# EAGLE design BrushBotComm_C3 (EAGLE 6.4)
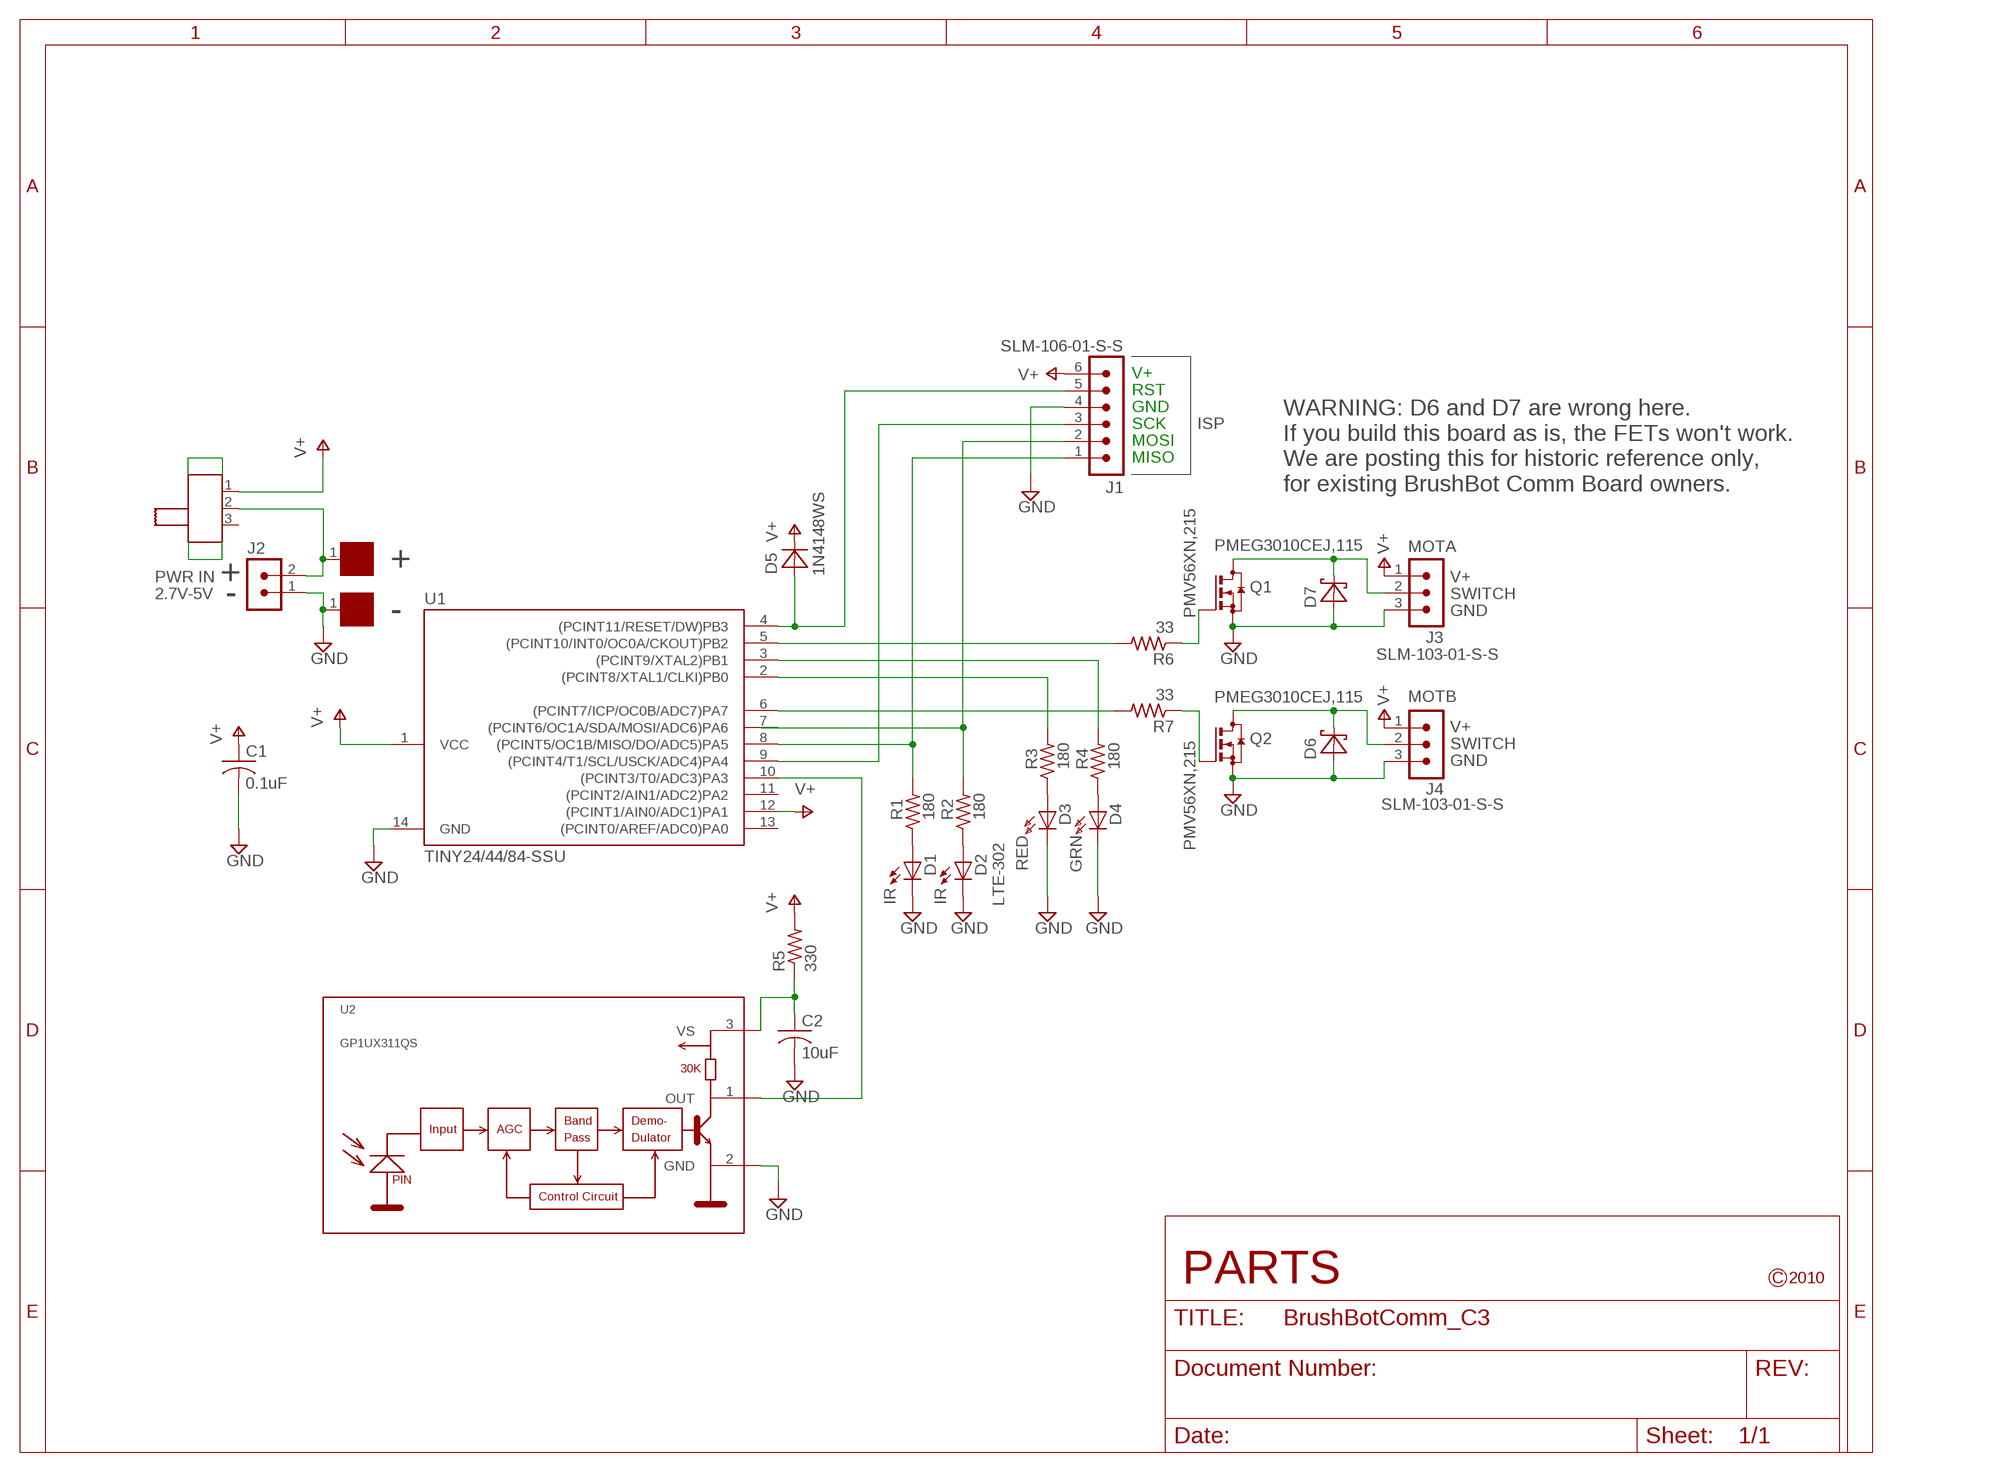
[diagram p0: schematic, sheet 1]

## Parts
+  BATTERM4X4MM  [BATTERM]
-  BATTERM4X4MM  [BATTERM]
C1  0.1uF  C-USC0603  [C0603]
C2  10uF  C-USC1206  [C1206]
D1  LTE-302  LEDIRL80A  [IRL80A]
D2  LTE-302  LEDIRL80A  [IRL80A]
D3  RED  LED603  [LED603]
D4  GRN  LED603  [LED603]
D5  1N4148WS  DIODE-SOD323-RE  [SOD323-R]
D6  PMEG3010CEJ,115  SCHOTTKYSOD323  [SOD323-R]
D7  PMEG3010CEJ,115  SCHOTTKYSOD323  [SOD323-R]
J1  SLM-106-01-S-S  MA06-1OCTPADS  [MA06O-1-25]
J2  MA02-1OCTPADS  [MA02O-1]
J3  SLM-103-01-S-S  MA03-1OCTPADS-25  [MA03O-1-25]
J4  SLM-103-01-S-S  MA03-1OCTPADS-25  [MA03O-1-25]
PWR  SSSS811101  SSSS8  [SSSS8]
Q1  PMV56XN,215  BSS123  [SOT23]
Q2  PMV56XN,215  BSS123  [SOT23]
R1  180  R-US_R0603  [R0603]
R2  180  R-US_R0603  [R0603]
R3  180  R-US_R0603  [R0603]
R4  180  R-US_R0603  [R0603]
R5  330  R-US_R0603  [R0603]
R6  33  R-US_R0603  [R0603]
R7  33  R-US_R0603  [R0603]
U1  TINY24/44/84-SSU  [SOIC14]
U2  GP1UX311QS  TSOP34830  [TSOP348]

## Nets
GND: -.1 C1.2 C2.2 D1.K(C) D2.K(C) D3.C D4.C D6.A D7.A J1.4 J2.1 J3.3 J4.3 Q1.2(S) Q2.2(S) U1.14(GND) U2.2(GND)
N$1: D1.A R1.1
N$2: D2.A R2.1
N$3: J1.2 R2.2 U1.7((PCINT6/OC1A/SDA/MOSI/ADC6)PA6)
N$4: J1.1 R1.2 U1.8((PCINT5/OC1B/MISO/DO/ADC5)PA5)
N$5: U1.10((PCINT3/T0/ADC3)PA3) U2.1(OUT)
N$6: R3.2 U1.2((PCINT8/XTAL1/CLKI)PB0)
N$7: R4.2 U1.3((PCINT9/XTAL2)PB1)
N$8: D3.A R3.1
N$9: D4.A R4.1
N$10: J1.3 U1.9((PCINT4/T1/SCL/USCK/ADC4)PA4)
N$11: D5.A J1.5 U1.4((PCINT11/RESET/DW)PB3)
N$12: C2.1 R5.1 U2.3(VS)
N$13: +.1 J2.2 PWR.2
N$14: PWR.G3 PWR.G4
N$15: PWR.G1 PWR.G2
N$16: R6.2 U1.5((PCINT10/INT0/OC0A/CKOUT)PB2)
N$17: R7.2 U1.6((PCINT7/ICP/OC0B/ADC7)PA7)
N$18: Q1.1(G) R6.1
N$19: Q2.1(G) R7.1
N$20: D7.C J3.2 Q1.3(D)
N$21: D6.C J4.2 Q2.3(D)
V+: C1.1 D5.C J1.6 J3.1 J4.1 PWR.1 R5.2 U1.1(VCC) U1.12((PCINT1/AIN0/ADC1)PA1)
Unconnected: PWR.3 U1.11((PCINT2/AIN1/ADC2)PA2) U1.13((PCINT0/AREF/ADC0)PA0)

## Notes on the sheet
- V+
- RST
- GND
- SCK | ISP
- MOSI
- MISO
- WARNING: D6 and D7 are wrong here.
  If you build this board as is, the FETs won't work.  
  We are posting this for historic reference only, 
  for existing BrushBot Comm Board owners.
- MOTA
- PWR IN | + | V+
- 2.7V-5V | SWITCH
- -
- GND
- MOTB
- V+
- SWITCH
- GND
- IR | IR
- PARTS | C | 2010

## Library data of the parts
+ - = battery_keystone:BATTERM: PCB button cell terminal
C1 C2 = my_rcl:C-US: CAPACITOR, American symbol
D1 D2 = led:LED: LED OSRAM: - CHIPLED LG R971, LG N971, LY N971, LG Q971, LY Q971, LO R971, LY R971 LH N974, LH R974 LS Q976, LO Q976, LY Q976 LO Q996 - Hyper CHIPLED LW Q18S LB Q993, LB Q99A, LB R99A - SideLED LS A670, LO A670, LY A670, LG A670, LP A670 LB A673, LV A673, LT A673, LW A673 LH A674 LY A675 LS A676, LA A676, LO A676, LY A676, LW A676 LS A679, LY A679, LG A679 - Hyper Micro SIDELED® LS Y876, LA Y876, LO Y876, LY Y876 LT Y87S - SmartLED LW L88C, LW L88S LB L89C, LB L89S, LG L890 LS L89K, LO L89K, LY L89K LS L896, LA L896, LO L896, LY L896 - TOPLED LS T670, LO T670, LY T670, LG T670, LP T670 LSG T670, LSP T670, LSY T670, LOP T670, LYG T670 LG T671, LOG T671, LSG T671 LB T673, LV T673, LT T673, LW T673 LH T674 LS T676, LA T676, LO T676, LY T676, LB T676, LH T676, LSB T676, LW T676 LB T67C, LV T67C, LT T67C, LS T67K, LO T67K, LY T67K, LW E67C LS E67B, LA E67B, LO E67B, LY E67B, LB E67C, LV E67C, LT E67C LW T67C LS T679, LY T679, LG T679 LS T770, LO T770, LY T770, LG T770, LP T770 LB T773, LV T773, LT T773, LW T773 LH T774 LS E675, LA E675, LY E675, LS T675 LS T776, LA T776, LO T776, LY T776, LB T776 LHGB T686 LT T68C, LB T68C - Hyper Mini TOPLED® LB M676 - Mini TOPLED Santana® LG M470 LS M47K, LO M47K, LY M47K Source: http://www.osram.convergy.de LUXEON: - LUMILED® LXK2-PW12-R00, LXK2-PW12-S00, LXK2-PW14-U00, LXK2-PW14-V00 LXK2-PM12-R00, LXK2-PM12-S00, LXK2-PM14-U00 LXK2-PE12-Q00, LXK2-PE12-R00, LXK2-PE12-S00, LXK2-PE14-T00, LXK2-PE14-U00 LXK2-PB12-K00, LXK2-PB12-L00, LXK2-PB12-M00, LXK2-PB14-N00, LXK2-PB14-P00, LXK2-PB14-Q00 LXK2-PR12-L00, LXK2-PR12-M00, LXK2-PR14-Q00, LXK2-PR14-R00 LXK2-PD12-Q00, LXK2-PD12-R00, LXK2-PD12-S00 LXK2-PH12-R00, LXK2-PH12-S00 LXK2-PL12-P00, LXK2-PL12-Q00, LXK2-PL12-R00 Source: www.luxeon.com KINGBRIGHT: KA-3528ASYC Source: www.kingbright.com
D3 D4 = my_led:LED603: Thin 603 LED Lite-ON
D5 = my_diode:DIODE-: DIODE
D6 D7 = my_diode:SCHOTTKY: Diodes Incorporated Schottky Diode SBR2A40P1-7
J1 = my_con:MA06-1
J2 = my_con:MA02-1: 0.050" 2-pin header
J3 J4 = my_con:MA03-1
PWR = microSwitch:SSSS8: ALPS SSSS811101 Miniature SPST side slide switch Also: COPAL CUS-12TB Also: C&K PCM12SMTR
Q1 Q2 = transistor-small-signal:BSS123: N-CHANNEL MOS FET
R1-R7 = my_rcl:R-US_: RESISTOR, American symbol
U1 = avr-6:TINY24/44/84
U2 = vishay-1:TSOP348*: IR Receiver Modules for Remote Control Systems http://www.vishay.com/ir-receiver-modules/

## Board
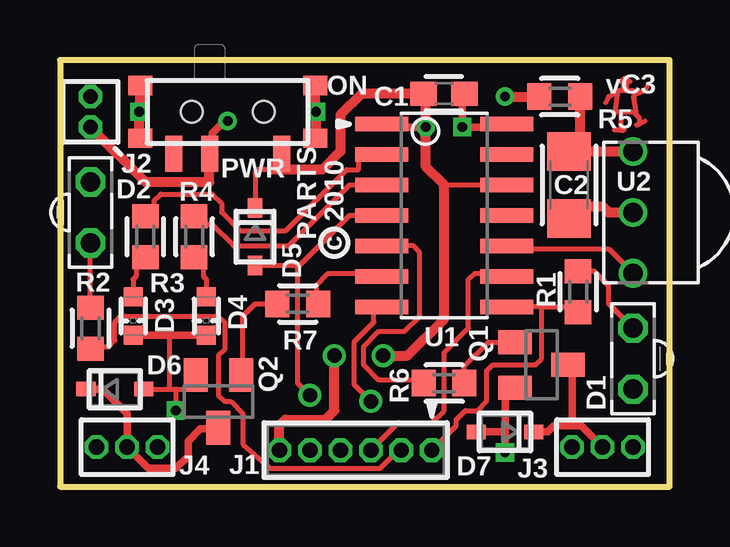
[diagram p1: board, top side]
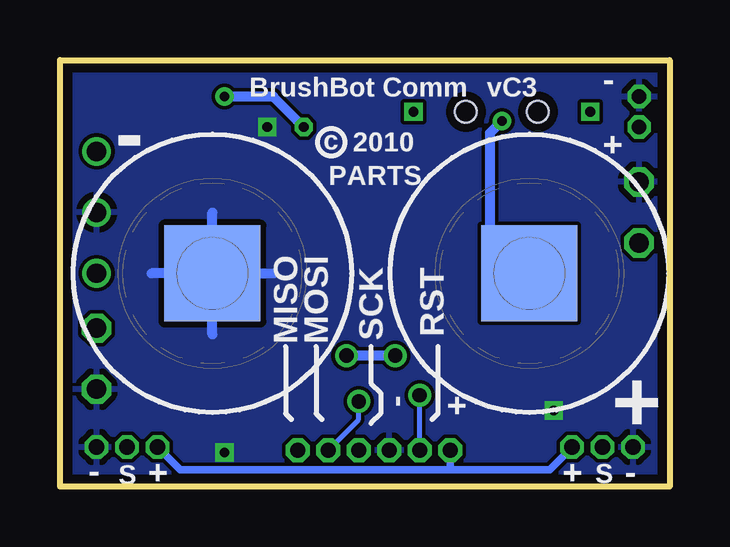
[diagram p2: board, bottom side, seen from below]

Size 25.4 x 17.78 mm. Coordinates in mm from the lower left corner, seen from the top.
Outline: 0,0 25.4,0 25.4,17.78 0,17.78 0,0
Copper layers (1*16): Top 0.0356mm / dielectric 1.5011mm / Bottom 0.0356mm
Design rules "LaenPCBOrder": minimum track width 6mil, minimum drill 13mil, track to track 6mil, track to pad 6mil, pad to pad 6mil, via to via 6mil, smd to smd 6mil, copper to edge 15mil, drill to drill 6mil, minimum pad ring 7mil, minimum via ring 7mil, stop-mask expansion 4mil, vias tented up to drill 0mil, thermal gap 10mil

### Footprints (pad centres in the part's own frame; a part is rotated, then mirrored left to right if it is on the bottom)
BATTERM = smd 4 x 4: 1 0,0
C0603 = smd 1.1 x 1: 1 -0.85,0; 2 0.85,0
C1206 = smd 1.6 x 1.8: 1 -1.4,0; 2 1.4,0
IRL80A = drill 0.813 octagon: A 0,-1.27; K 0,1.27
LED603 = smd 0.8 x 0.8: A -0.8,0; C 0.8,0
SOD323-R = smd 0.8 x 0.6: A 1.2,0; C -1.2,0
MA06O-1-25 = drill 0.635 pad 0.889 octagon: 1 -2.54,0; 2 -1.27,0; 3 0,0; 4 1.27,0; 5 2.54,0; 6 3.81,0
MA02O-1 = drill 0.61 pad 0.813 octagon: 1 -1.27,0; 2 0,0
MA03O-1-25 = drill 0.635 octagon: 1 -1.27,0; 2 0,0; 3 1.27,0
SSSS8 = smd 0.7 x 1.5: 1 -2.25,1.75; 2 0.75,1.75; 3 2.25,1.75 | smd 1 x 0.8: G1 -3.65,1.1; G2 -3.65,-1.1; G3 3.65,-1.1; G4 3.65,1.1 | hole 0.9: -1.5,0; 1.5,0
SOT23 = smd 1 x 1.4: 1 -0.95,-1.1; 2 0.95,-1.1; 3 0,1.1
R0603 = smd 1 x 1.1: 1 -0.85,0; 2 0.85,0
SOIC14 = smd 0.61 x 2.21: 1 -3.81,-2.603; 2 -2.54,-2.603; 3 -1.27,-2.603; 4 0,-2.603; 5 1.27,-2.603; 6 2.54,-2.603; 7 3.81,-2.603; 8 3.81,2.603; 9 2.54,2.603; 10 1.27,2.603; 11 0,2.603; 12 -1.27,2.603; 13 -2.54,2.603; 14 -3.81,2.603
TSOP348 = drill 0.8 round: 1 -2.54,0; 2 0,0; 3 2.54,0

### Placement (x,y rotation side)
+  5.84,8.89 0 bottom
-  19.05,8.89 0 bottom
C1  16,16.38 0 top
C2  21.21,12.57 270 top
D1  23.88,5.33 180 top
D2  1.27,11.43 0 top
D3  3.05,7.11 270 top
D4  6.1,7.11 270 top
D5  8.13,10.41 270 top
D6  2.29,4.06 0 top
D7  18.54,2.29 180 top
J1  12.95,1.52 180 top
J2  1.27,14.99 270 top
J3  22.61,1.65 0 top
J4  2.79,1.65 180 top
PWR  6.99,15.62 180 top
Q1  20.07,5.08 270 top
Q2  6.6,3.56 180 top
R1  21.59,8.13 270 top
R2  1.27,6.6 270 top
R3  3.56,10.41 90 top
R4  5.59,10.41 90 top
R5  20.83,16.26 180 top
R6  16,4.32 180 top
R7  9.91,7.62 0 top
U1  16,11.3 270 top
U2  23.88,11.43 90 top
U$1  [CHASSIS]  13.46,8.89 0 top

### Tracks (layer width: path | path; a pad name or v marks a point on that pad's centre or on a via)
GND  (via drill 0.41)
  Top 0.203: D6.A 4.57,4.06 | 4.57,4.06 4.83,4.06 | 4.83,4.06 v4.83,3.17 | 4.83,4.06 5.4,4.06 Q2.2 5.97,4.66 | 5.97,6.31 D4.C 4.57,6.31 4.57,4.06
  Top 0.305: C1.2 16.76,16.26 16.75,16.24 v16.75,14.99 v16.76,14.99 17.91,14.99 17.91,15.11 U1.14 | 18.87,3.88 Q1.2 18.8,4.06 18.54,4.06 18.54,2.29 | 18.54,2.29 v18.54,1.42 | D7.A 18.54,2.29 | D4.C D3.C
  Top 0.406: C2.2 21.21,11.68 22.61,11.68 22.86,11.43 U2.2
  Bottom 0.406: -.1 16.51,8.89 | -.1 19.05,11.43 | -.1 21.59,8.89 | 19.05,6.35 -.1
  pour Bottom: 0,-0.25 25.4,-0.25 25.4,17.78 0,17.78
N$1
  Top 0.203: R1.1 22.26,8.98 22.86,8.38 22.86,7.62 D1.A
N$2
  Top 0.203: R2.1 D2.A
N$3  (via drill 0.6)
  Top 0.203: U1.7 12.83,7.37 | U1.7 13.72,7.49 | R2.2 1.36,5.84 2.03,5.84 2.29,6.1 2.29,6.86 2.54,7.11 6.6,7.11 6.86,6.86 6.86,5.71 6.6,5.46 6.6,3.81 6.86,3.56 7.11,3.56 7.62,3.05 7.62,1.78 8.76,0.76 13.34,0.76 14.1,1.52 J1.2 | U1.7 13.08,7.49 13.08,6.86 12.27,6.04 12.27,4.24 v12.95,3.56
  Bottom 0.203: v12.95,3.56 12.95,2.79 J1.2
N$4
  Top 0.203: 20.07,7.49 U1.8 | 20.07,7.49 21.59,7.49 R1.2 | 20.07,7.49 20.07,5.33 19.81,5.08 18.03,5.08 17.78,4.83 17.78,3.56 17.4,3.17 16.89,3.17 16.51,2.79 16.51,2.54 J1.1
N$5
  Top 0.203: U1.10 19.3,10.03 19.3,9.91 22.86,9.91 U2.1
N$6
  Top 0.203: R3.2 3.94,11.26 3.94,11.94 4.19,12.19 6.35,12.19 6.73,11.81 6.73,11.43 7.49,10.67 9.4,10.67 11.94,13.21 12.45,13.21 12.45,13.84 U1.2
N$7
  Top 0.203: R4.2 5.59,10.92 6.35,10.92 7.24,10.03 9.53,10.03 12.06,12.57 U1.3
N$8
  Top 0.203: D3.A 3.05,8.64 3.17,8.76 3.17,9.18 R3.1
N$9
  Top 0.203: D4.A 6.1,8.64 5.97,8.76 5.97,9.18 R4.1
N$10
  Top 0.203: U1.9 18.54,8.89 17.27,8.89 17.02,8.64 17.02,6.6 16,5.59 16,3.17 15.49,2.67 14.1,2.67 J1.3
N$11  (via drill 0.6)
  Top 0.203: D5.A 9.85,9.21 9.91,9.14 | 9.91,9.14 12.06,11.3 U1.4 | 9.91,9.14 9.91,4.32 v10.41,3.81
  Bottom 0.203: J1.5 v10.41,3.81
N$12
  Top 0.406: R5.1 21.68,13.97 C2.1 U2.3
N$13  (via drill 0.41)
  Top 0.305: v6.99,15.24 6.86,15.24 6.35,14.73 6.35,13.97 PWR.2
  Top 0.406: J2.2 3.56,12.7 6.22,12.7 6.22,13.72 PWR.2
  Bottom 0.406: +.1 7.49,8.89 7.49,14.73 v6.99,15.24
N$14  (via drill 0.41)
  Top 0.406: PWR.G4 3.3,14.55 v3.3,15.62 3.33,15.65 PWR.G3
N$15  (via drill 0.41)
  Top 0.406: PWR.G1 10.67,14.55 v10.67,15.62 10.63,15.65 PWR.G2
N$16
  Top 0.203: U1.5 14.73,10.03 14.99,9.78 14.99,7.11 14.35,6.48 13.28,6.48 12.65,5.84 12.65,5.08 13.28,4.45 15.15,4.45 R6.2
N$17
  Top 0.203: U1.6 13.21,8.89 11.18,8.89 10.67,8.38 R7.2
N$18
  Top 0.203: Q1.1 17.84,6.03 16.85,5.04 R6.1
N$19
  Top 0.203: R7.1 8.13,7.62 7.62,7.11 7.62,4.83 Q2.1
N$20
  Top 0.305: Q1.3 21.27,4.83 | D7.C 20.32,2.29 20.57,2.54 21.34,2.54 | 21.34,2.54 21.72,2.54 J3.2 | 21.34,2.54 21.34,4.83
  Top 0.406: 21.34,4.83 Q1.3
N$21
  Top 0.305: D6.C 1.78,4.06 2.79,3.05 J4.2 3.68,0.76 4.83,0.76 5.33,1.27 5.33,1.91 5.84,2.41 6.6,2.41 Q2.3 6.35,2.54
N$22
  Top 0.203: 23.37,15.62 23.11,15.62 23.24,16.51 | 23.37,15.62 23.88,15.62 | 23.88,15.62 24,15.62 23.92,16.23 | 23.92,16.23 23.88,16.51 23.62,16.51 | 23.5,16.51 23.62,16.51 | 23.24,16.51 23.5,16.51 | 23.37,15.62 23.37,14.86 | 23.37,14.86 23.11,14.86 | 23.37,14.86 23.5,14.86 | 23.88,15.62 24.13,15.37 24.13,15.11 | 24.13,15.11 24.03,15.06 | 24.13,15.11 24.38,15.24 | 23.5,16.51 23.5,16.89 | 23.62,16.51 23.62,17.02 23.5,17.02 23.5,16.89 | 22.73,16 22.86,16.26 23.11,16.38 arc90 23.24,16.51 | 24.51,16.76 24.38,16.51 24,16.38 arc90 23.92,16.3 23.92,16.23 | 23.5,16.89 23.75,16.89 | 23.5,16.89 23.37,16.89
V+  (via drill 0.41, 0.6)
  Top 0.203: D5.C 8.13,13.08 8.26,13.21 8.85,13.21 | 16,12.57 U1.12 | 9.14,13.21 PWR.1
  Top 0.305: v15.24,14.99 13.97,14.99 13.97,15.11 U1.1 | 15.24,16.14 C1.1
  Top 0.406: 15.24,16.14 v15.24,14.99 15.24,13.34 16,12.57 16,6.99 14.48,5.46 v13.46,5.46 | PWR.1 8.85,13.21 9.14,13.21 10.92,13.21 11.68,13.97 11.68,15.49 12.57,16.38 C1.1 | v18.54,16.26 R5.2 | v11.43,5.46 11.43,3.17 11.05,2.79 9.4,2.79 9.14,2.54 J1.6
  Bottom 0.305: J4.1 5,0.71 9.14,0.71 | J3.1 20.4,0.71 9.14,0.71 | 9.14,0.71 J1.6
  Bottom 0.406: v15.24,14.99 16.51,16.26 v18.54,16.26 | v11.43,5.46 v13.46,5.46

### Text on the board
tNames: ON | vC3 | 2010 | PARTS | c
bNames: - | vC3 | BrushBot Comm | + | 2010 | c | PARTS | MOSI | MISO | RST | SCK | + | - | - | S | + | + | S | -
tValues: - | + | 2.7V-5V | V+ | SWITCH | GND | V+ | RESET | GND | SCK | MOSI | MISO | V+ | SWITCH | GND | MOTB | ISP | MOTA
Measures: 1.0" | 0.7"
Document: BrushBot Comm Board | 3/5/2010 | Ver C2 | Component Placement